# EAGLE design mma_breakout (EAGLE 7.1.0)
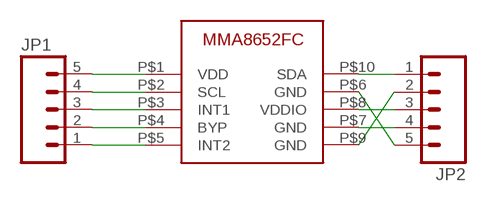
[diagram p0: schematic, sheet 1]

## Parts
JP1  M05PTH  [1X05]
JP2  M05PTH  [1X05]
U$1  MMA8652FC  [MMA8652FC]

## Nets
N$1: JP1.5 U$1.P$1(VDD)
N$2: JP1.4 U$1.P$2(SCL)
N$3: JP2.5 U$1.P$6(GND)
N$4: JP2.4 U$1.P$7(GND)
N$5: JP1.1 U$1.P$5(INT2)
N$6: JP2.1 U$1.P$10(SDA)
N$7: JP1.3 U$1.P$3(INT1)
N$8: JP1.2 U$1.P$4(BYP)
N$9: JP2.3 U$1.P$8(VDDIO)
N$10: JP2.2 U$1.P$9(GND)

## Library data of the parts
JP1 JP2 = SparkFun-Connectors:M05: Header 5 Standard 5-pin 0.1" header. Use with straight break away headers (SKU : PRT-00116), right angle break away headers (PRT-00553), swiss pins (PRT-00743), machine pins (PRT-00117), and female headers (PRT-00115). Molex polarized connector foot print use with SKU : PRT-08230 with associated crimp pins and housings.
U$1 = talons:MMA8652FC

## Board
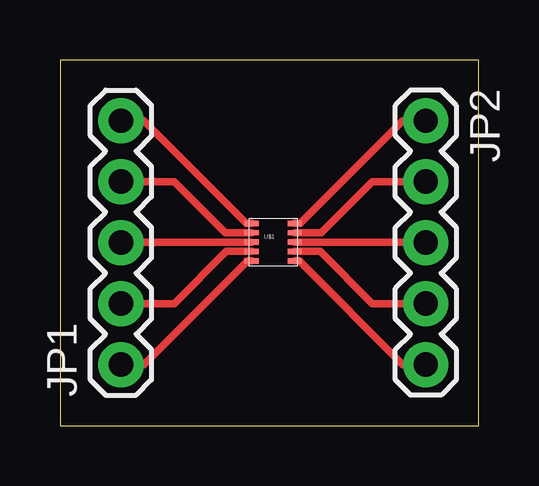
[diagram p1: board, top side]

Size 17.45 x 15.23 mm. Coordinates in mm from the lower left corner, seen from the top.
Outline: 0,0 17.45,0 17.45,15.23 0,15.23 0,0
Copper layers (1*16): Top 0.035mm / dielectric 1.5mm / Bottom 0.035mm
Design rules "default": minimum track width 10mil, minimum drill 24mil, track to track 8mil, track to pad 8mil, pad to pad 8mil, via to via 8mil, smd to smd 8mil, copper to edge 40mil, drill to drill 8mil, minimum pad ring 10mil, minimum via ring 8mil, stop-mask expansion 4mil, vias tented up to drill 0mil, thermal gap 10mil

### Footprints (pad centres in the part's own frame; a part is rotated, then mirrored left to right if it is on the bottom)
1X05 = drill 1.016 pad 1.88: 1 0,0; 2 2.54,0; 3 5.08,0; 4 7.62,0; 5 10.16,0
MMA8652FC = smd 0.6 x 0.225: P$1 0.362,1.755; P$2 0.362,1.365; P$3 0.362,0.975; P$4 0.362,0.585; P$5 0.362,0.195; P$6 2.163,0.195; P$7 2.163,0.585; P$8 2.163,0.975; P$9 2.163,1.365; P$10 2.163,1.755

### Placement (x,y rotation side)
JP1  2.54,2.54 90 top
JP2  15.24,12.7 270 top
U$1  7.62,6.67 0 top

### Tracks (layer width: path | path; a pad name or v marks a point on that pad's centre or on a via)
N$1
  Top 0.305: U$1.P$1 7.77,8.42 3.49,12.7 JP1.5
N$2
  Top 0.305: U$1.P$2 6.89,8.03 4.76,10.16 JP1.4
N$3
  Top 0.305: U$1.P$6 9.96,6.86 14.29,2.54 JP2.5
N$4
  Top 0.305: U$1.P$7 10.85,7.25 13.02,5.08 JP2.4
N$5
  Top 0.305: U$1.P$5 7.82,6.86 3.49,2.54 JP1.1
N$6
  Top 0.305: U$1.P$10 10.01,8.42 14.29,12.7 JP2.1
N$7
  Top 0.305: U$1.P$3 2.56,7.64 JP1.3
N$8
  Top 0.305: U$1.P$4 6.93,7.25 4.76,5.08 JP1.2
N$9
  Top 0.305: U$1.P$8 15.22,7.64 JP2.3
N$10
  Top 0.305: U$1.P$9 10.89,8.03 13.02,10.16 JP2.2